# EAGLE design stm32f4discovery-daugherboard-v1-THT (EAGLE 6.2)
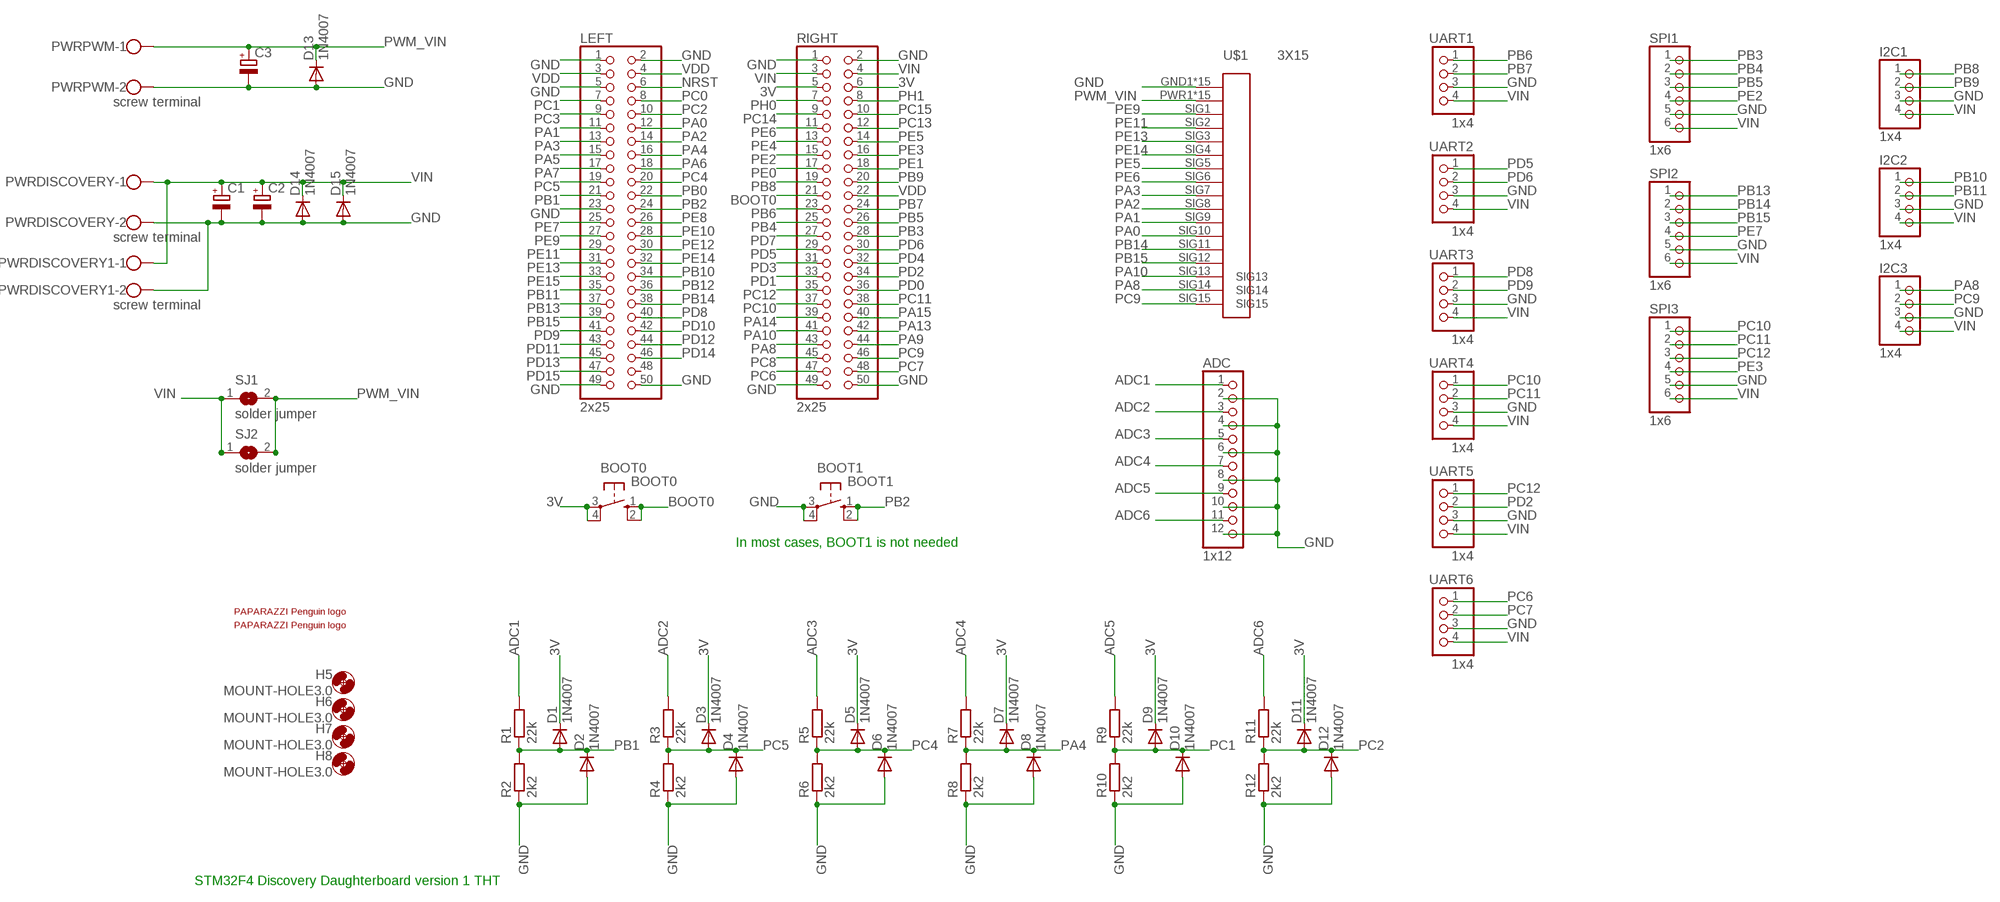
[diagram p0: schematic, sheet 1]

## Parts
ADC  1x12  PINHD-1X12/90  [1X12/90]
BOOT0  BOOT0  10-XX  [B3F-10XX]
BOOT1  BOOT1  10-XX  [B3F-10XX]
C1  CPOL-EUE5-8.5  [E5-8,5]
C2  CPOL-EUE5-8.5  [E5-8,5]
C3  CPOL-EUE5-8.5  [E5-8,5]
D1  1N4007  [DO41-7.6_2]
D2  1N4007  [DO41-7.6_2]
D3  1N4007  [DO41-7.6_2]
D4  1N4007  [DO41-7.6_2]
D5  1N4007  [DO41-7.6_2]
D6  1N4007  [DO41-7.6_2]
D7  1N4007  [DO41-7.6_2]
D8  1N4007  [DO41-7.6_2]
D9  1N4007  [DO41-7.6_2]
D10  1N4007  [DO41-7.6_2]
D11  1N4007  [DO41-7.6_2]
D12  1N4007  [DO41-7.6_2]
D13  1N4007  [DO41-7.6_2]
D14  1N4007  [DO41-7.6_2]
D15  1N4007  [DO41-7.6_2]
H5  MOUNT-HOLE3.0  [3,0]
H6  MOUNT-HOLE3.0  [3,0]
H7  MOUNT-HOLE3.0  [3,0]
H8  MOUNT-HOLE3.0  [3,0]
I2C1  1x4  PINHD-1X4/90  [1X04/90]
I2C2  1x4  PINHD-1X4/90  [1X04/90]
I2C3  1x4  PINHD-1X4/90  [1X04/90]
LEFT  2x25  PINHD-2X25  [2X25]
PWRDISCOVERY  screw terminal  W237-102  [W237-102]
PWRDISCOVERY1  screw terminal  W237-102  [W237-102]
PWRPWM  screw terminal  W237-102  [W237-102]
R1  22k  R-EU_0204/7  [0204/7]
R2  2k2  R-EU_0204/7  [0204/7]
R3  22k  R-EU_0204/7  [0204/7]
R4  2k2  R-EU_0204/7  [0204/7]
R5  22k  R-EU_0204/7  [0204/7]
R6  2k2  R-EU_0204/7  [0204/7]
R7  22k  R-EU_0204/7  [0204/7]
R8  2k2  R-EU_0204/7  [0204/7]
R9  22k  R-EU_0204/7  [0204/7]
R10  2k2  R-EU_0204/7  [0204/7]
R11  22k  R-EU_0204/7  [0204/7]
R12  2k2  R-EU_0204/7  [0204/7]
RIGHT  2x25  PINHD-2X25  [2X25]
SJ1  solder jumper  SJW  [SJW]
SJ2  solder jumper  SJW  [SJW]
SPI1  1x6  PINHD-1X6/90  [1X06/90]
SPI2  1x6  PINHD-1X6/90  [1X06/90]
SPI3  1x6  PINHD-1X6/90  [1X06/90]
U$1  3X15  [3X15]
U$2  PAPARAZZI  [PAPARAZZI]
U$4  üAüARAZZI_1400  [PAPARAZZI_1400]
UART1  1x4  PINHD-1X4/90  [1X04/90]
UART2  1x4  PINHD-1X4/90  [1X04/90]
UART3  1x4  PINHD-1X4/90  [1X04/90]
UART4  1x4  PINHD-1X4/90  [1X04/90]
UART5  1x4  PINHD-1X4/90  [1X04/90]
UART6  1x4  PINHD-1X4/90  [1X04/90]

## Nets
3V: BOOT0.3(P) BOOT0.4(P1) D1.C D3.C D5.C D7.C D9.C D11.C RIGHT.5 RIGHT.6
ADC1: ADC.1 R1.2
ADC2: ADC.3 R3.2
ADC3: ADC.5 R5.2
ADC4: ADC.7 R7.2
ADC5: ADC.9 R9.2
ADC6: ADC.11 R11.2
BOOT0: BOOT0.1(S) BOOT0.2(S1) RIGHT.21
GND: ADC.2 ADC.4 ADC.6 ADC.8 ADC.10 ADC.12 BOOT1.3(P) BOOT1.4(P1) C1.- C2.- C3.- D2.A D4.A D6.A D8.A D10.A D12.A D13.A D14.A D15.A I2C1.3 I2C2.3 I2C3.3 LEFT.1 LEFT.2 LEFT.5 LEFT.23 LEFT.49 LEFT.50 PWRDISCOVERY1.2 PWRDISCOVERY.2 PWRPWM.2 R2.1 R4.1 R6.1 R8.1 R10.1 R12.1 RIGHT.1 RIGHT.2 RIGHT.49 RIGHT.50 SPI1.5 SPI2.5 SPI3.5 U$1.GND1(GND) U$1.GND2(GND) U$1.GND3(GND) U$1.GND4(GND) U$1.GND5(GND) U$1.GND6(GND) U$1.GND7(GND) U$1.GND8(GND) U$1.GND9(GND) U$1.GND10(GND) U$1.GND11(GND) U$1.GND12(GND) U$1.GND13(GND) U$1.GND14(GND) U$1.GND15(GND) UART1.3 UART2.3 UART3.3 UART4.3 UART5.3 UART6.3
NRST: LEFT.6
PA0: LEFT.12 U$1.SIG10
PA1: LEFT.11 U$1.SIG9
PA2: LEFT.14 U$1.SIG8
PA3: LEFT.13 U$1.SIG7
PA4: D7.A D8.C LEFT.16 R7.1 R8.2
PA5: LEFT.15
PA6: LEFT.18
PA7: LEFT.17
PA8: I2C3.1 RIGHT.43 U$1.SIG14
PA9: RIGHT.44
PA10: RIGHT.41 U$1.SIG13
PA13: RIGHT.42
PA14: RIGHT.39
PA15: RIGHT.40
PB0: LEFT.22
PB1: D1.A D2.C LEFT.21 R1.1 R2.2
PB2: BOOT1.1(S) BOOT1.2(S1) LEFT.24
PB3: RIGHT.28 SPI1.1
PB4: RIGHT.25 SPI1.2
PB5: RIGHT.26 SPI1.3
PB6: RIGHT.23 UART1.1
PB7: RIGHT.24 UART1.2
PB8: I2C1.1 RIGHT.19
PB9: I2C1.2 RIGHT.20
PB10: I2C2.1 LEFT.34
PB11: I2C2.2 LEFT.35
PB12: LEFT.36
PB13: LEFT.37 SPI2.1
PB14: LEFT.38 SPI2.2 U$1.SIG11
PB15: LEFT.39 SPI2.3 U$1.SIG12
PC0: LEFT.8
PC1: D9.A D10.C LEFT.7 R9.1 R10.2
PC2: D11.A D12.C LEFT.10 R11.1 R12.2
PC3: LEFT.9
PC4: D5.A D6.C LEFT.20 R5.1 R6.2
PC5: D3.A D4.C LEFT.19 R3.1 R4.2
PC6: RIGHT.47 UART6.1
PC7: RIGHT.48 UART6.2
PC8: RIGHT.45
PC9: I2C3.2 RIGHT.46 U$1.SIG15
PC10: RIGHT.37 SPI3.1 UART4.1
PC11: RIGHT.38 SPI3.2 UART4.2
PC12: RIGHT.35 SPI3.3 UART5.1
PC13: RIGHT.12
PC14: RIGHT.9
PC15: RIGHT.10
PD0: RIGHT.36
PD1: RIGHT.33
PD2: RIGHT.34 UART5.2
PD3: RIGHT.31
PD4: RIGHT.32
PD5: RIGHT.29 UART2.1
PD6: RIGHT.30 UART2.2
PD7: RIGHT.27
PD8: LEFT.40 UART3.1
PD9: LEFT.41 UART3.2
PD10: LEFT.42
PD11: LEFT.43
PD12: LEFT.44
PD13: LEFT.45
PD14: LEFT.46
PD15: LEFT.47
PE0: RIGHT.17
PE1: RIGHT.18
PE2: RIGHT.15 SPI1.4
PE3: RIGHT.16 SPI3.4
PE4: RIGHT.13
PE5: RIGHT.14 U$1.SIG5
PE6: RIGHT.11 U$1.SIG6
PE7: LEFT.25 SPI2.4
PE8: LEFT.26
PE9: LEFT.27 U$1.SIG1
PE10: LEFT.28
PE11: LEFT.29 U$1.SIG2
PE12: LEFT.30
PE13: LEFT.31 U$1.SIG3
PE14: LEFT.32 U$1.SIG4
PE15: LEFT.33
PH0: RIGHT.7
PH1: RIGHT.8
PWM_VIN: C3.+ D13.C PWRPWM.1 SJ1.2 SJ2.2 U$1.PWR1(PWR) U$1.PWR2(PWR) U$1.PWR3(PWR) U$1.PWR4(PWR) U$1.PWR5(PWR) U$1.PWR6(PWR) U$1.PWR7(PWR) U$1.PWR8(PWR) U$1.PWR9(PWR) U$1.PWR10(PWR) U$1.PWR11(PWR) U$1.PWR12(PWR) U$1.PWR13(PWR) U$1.PWR14(PWR) U$1.PWR15(PWR)
VDD: LEFT.3 LEFT.4 RIGHT.22
VIN: C1.+ C2.+ D14.C D15.C I2C1.4 I2C2.4 I2C3.4 PWRDISCOVERY1.1 PWRDISCOVERY.1 RIGHT.3 RIGHT.4 SJ1.1 SJ2.1 SPI1.6 SPI2.6 SPI3.6 UART1.4 UART2.4 UART3.4 UART4.4 UART5.4 UART6.4
Unconnected: LEFT.48

## Notes on the sheet
- In most cases, BOOT1 is not needed
- STM32F4 Discovery Daughterboard version 1 THT

## Library data of the parts
ADC = pinhead:PINHD-1X12: PIN HEADER
BOOT0 BOOT1 = switch-omron:10-XX: OMRON SWITCH; MPN: B3F-1000; OC_FARNELL: 176432; OC_NEWARK: 36M3542
C1-C3 = rcl:CPOL-EU: POLARIZED CAPACITOR, European symbol
D1-D15 = diode:1N4007
H5-H8 = holes:MOUNT-HOLE: MOUNTING HOLE with drill center marker
I2C1-I2C3 UART1-UART6 = pinhead:PINHD-1X4: PIN HEADER
LEFT RIGHT = pinhead:PINHD-2X25: PIN HEADER
PWRDISCOVERY PWRDISCOVERY1 PWRPWM = con-wago-500:W237-102: WAGO SCREW CLAMP; MPN: 237-102; OC_FARNELL: unknown; OC_NEWARK: 70K9898
R1-R12 = rcl:R-EU_: RESISTOR, European symbol
SJ1 SJ2 = jumper:SJ: SMD solder JUMPER
SPI1-SPI3 = pinhead:PINHD-1X6: PIN HEADER
U$1 = pinhead3:3X15
U$2 = paparazzi:PAPARAZZI
U$4 = paparazzi:üAüARAZZI_1400

## Board
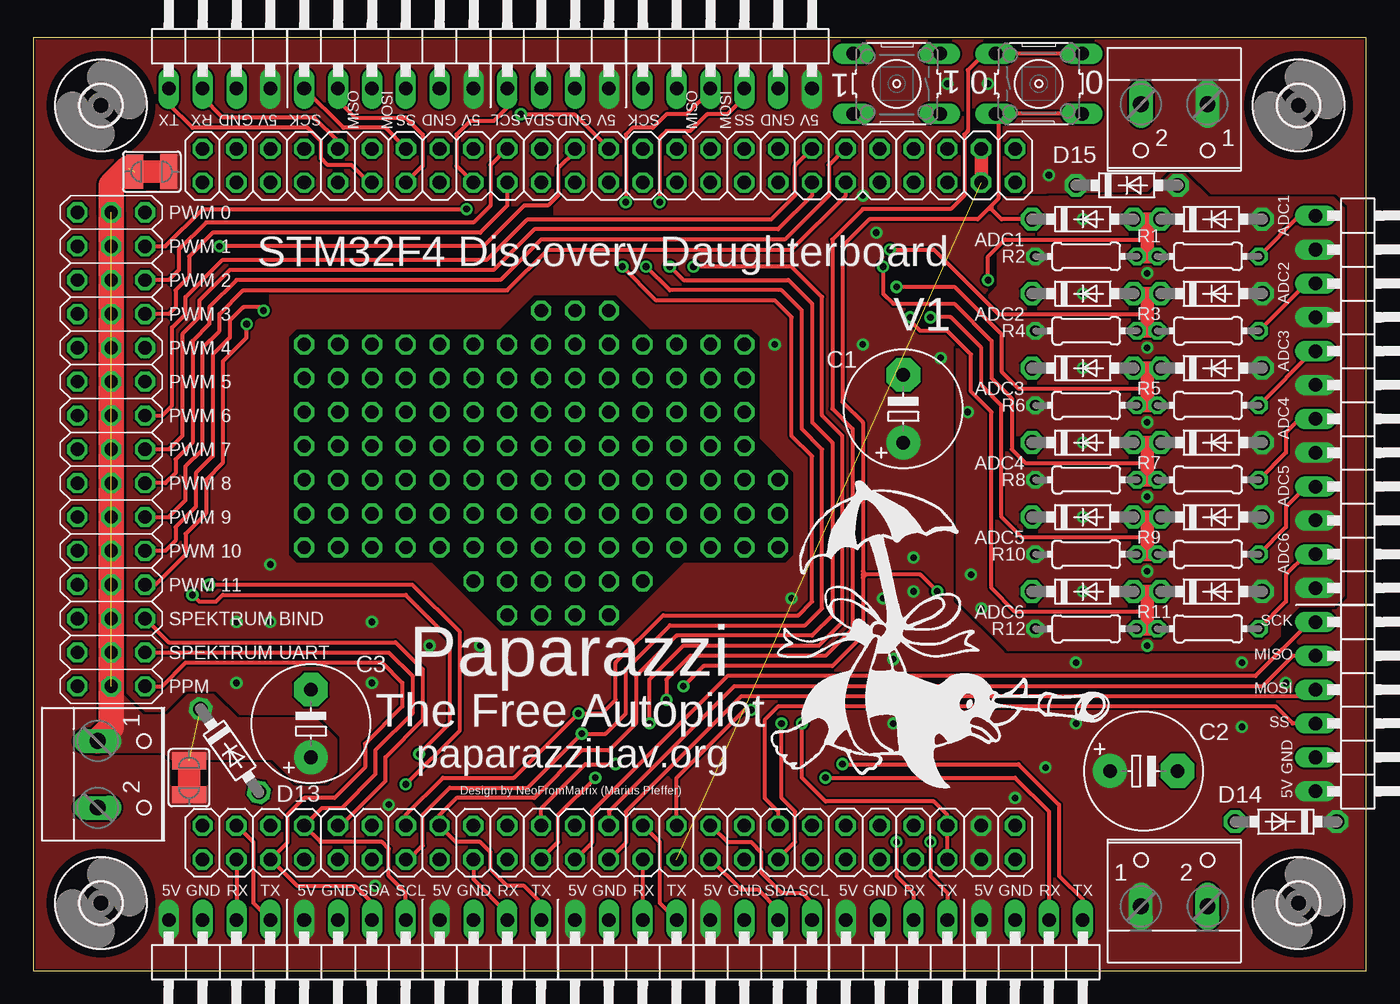
[diagram p1: board, top side]
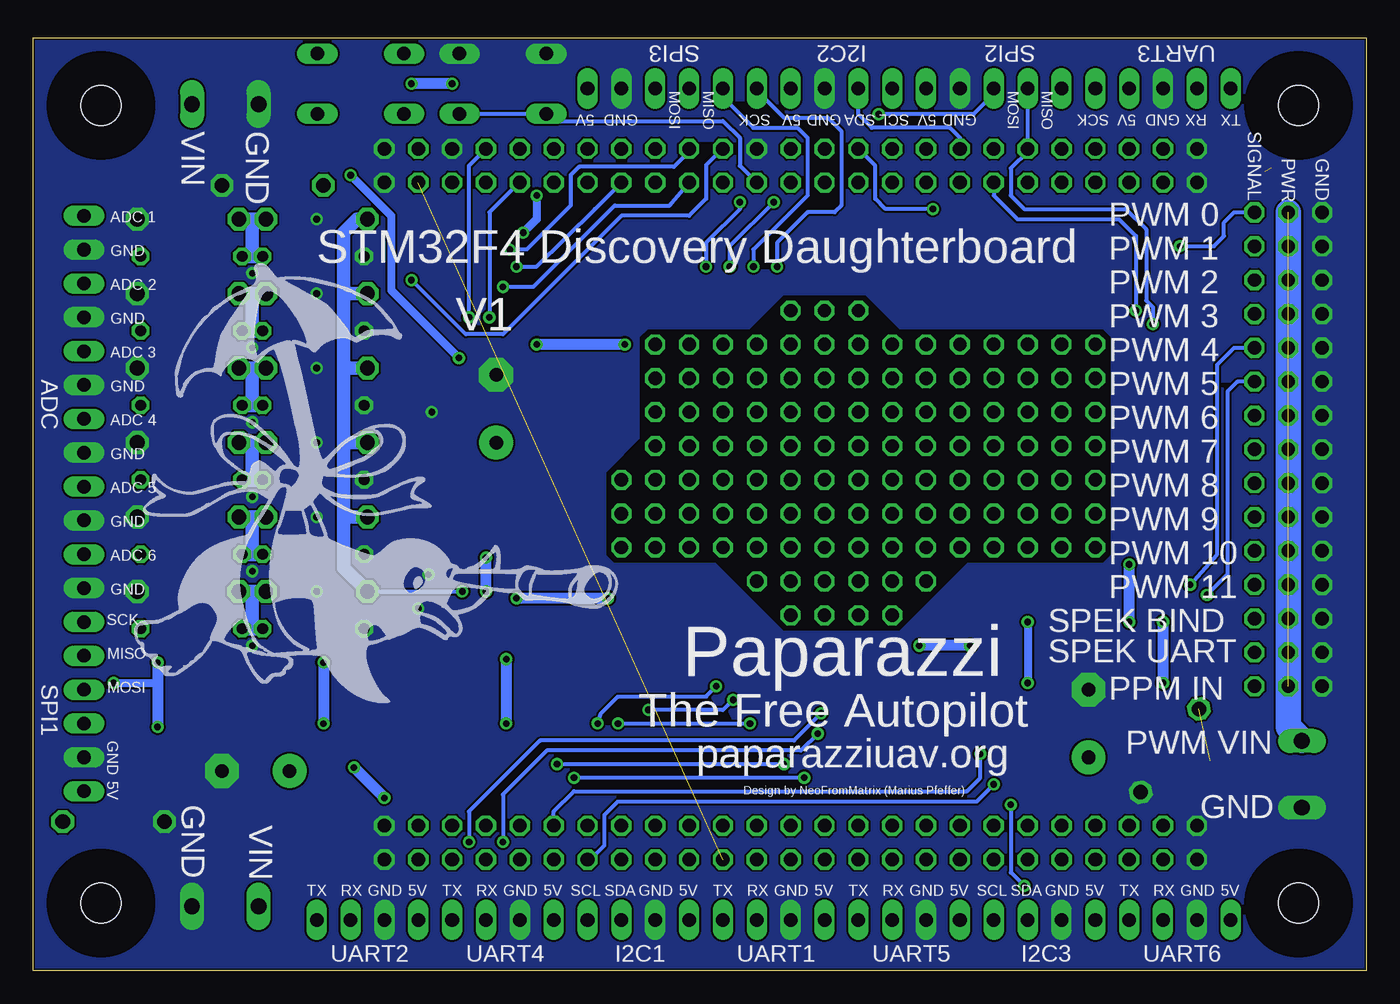
[diagram p2: board, bottom side, seen from below]

Size 100 x 70 mm. Coordinates in mm from the lower left corner, seen from the top.
Outline: 0,0 100,0 100,70 0,70 0,0
Copper layers (1*16): Top 0.035mm / dielectric 1.5mm / Bottom 0.035mm
Design rules: minimum track width 6mil, minimum drill 19mil, track to track 6mil, track to pad 6mil, pad to pad 6mil, via to via 6mil, smd to smd 6mil, copper to edge 6mil, drill to drill 6mil, minimum pad ring 10mil, minimum via ring 8mil, stop-mask expansion 4mil, vias tented up to drill 0mil, thermal gap 7mil

### Footprints (pad centres in the part's own frame; a part is rotated, then mirrored left to right if it is on the bottom)
1X12/90 = drill 1.016 long: 1 -13.97,-3.81; 2 -11.43,-3.81; 3 -8.89,-3.81; 4 -6.35,-3.81; 5 -3.81,-3.81; 6 -1.27,-3.81; 7 1.27,-3.81; 8 3.81,-3.81; 9 6.35,-3.81; 10 8.89,-3.81; 11 11.43,-3.81; 12 13.97,-3.81
B3F-10XX = drill 1.016 long: 1 -3.251,2.261; 2 3.251,2.261; 3 -3.251,-2.261; 4 3.251,-2.261
E5-8,5 = drill 1.016 pad 2.54: + -2.54,0 | drill 1.016 pad 2.54 octagon: - 2.54,0
DO41-7.6_2 = drill 1.1 pad 1.7 octagon: A 3.81,0; C -3.81,0
3,0 = hole 3: 0,0
1X04/90 = drill 1.016 long: 1 -3.81,-3.81; 2 -1.27,-3.81; 3 1.27,-3.81; 4 3.81,-3.81
2X25 = drill 1.016 octagon: 1 -30.48,-1.27; 2 -30.48,1.27; 3 -27.94,-1.27; 4 -27.94,1.27; 5 -25.4,-1.27; 6 -25.4,1.27; 7 -22.86,-1.27; 8 -22.86,1.27; 9 -20.32,-1.27; 10 -20.32,1.27; 11 -17.78,-1.27; 12 -17.78,1.27; 13 -15.24,-1.27; 14 -15.24,1.27; 15 -12.7,-1.27; 16 -12.7,1.27; 17 -10.16,-1.27; 18 -10.16,1.27; 19 -7.62,-1.27; 20 -7.62,1.27; 21 -5.08,-1.27; 22 -5.08,1.27; 23 -2.54,-1.27; 24 -2.54,1.27; 25 0,-1.27; 26 0,1.27; 27 2.54,-1.27; 28 2.54,1.27; 29 5.08,-1.27; 30 5.08,1.27; 31 7.62,-1.27; 32 7.62,1.27; 33 10.16,-1.27; 34 10.16,1.27; 35 12.7,-1.27; 36 12.7,1.27; 37 15.24,-1.27; 38 15.24,1.27; 39 17.78,-1.27; 40 17.78,1.27; 41 20.32,-1.27; 42 20.32,1.27; 43 22.86,-1.27; 44 22.86,1.27; 45 25.4,-1.27; 46 25.4,1.27; 47 27.94,-1.27; 48 27.94,1.27; 49 30.48,-1.27; 50 30.48,1.27
W237-102 = drill 1.194 long: 1 -2.5,-1.27; 2 2.5,-1.27
0204/7 = drill 0.813 octagon: 1 -3.81,0; 2 3.81,0
SJW = smd 1.27 x 2.54: 1 -1.27,0; 2 1.27,0
1X06/90 = drill 1.016 long: 1 -6.35,-3.81; 2 -3.81,-3.81; 3 -1.27,-3.81; 4 1.27,-3.81; 5 3.81,-3.81; 6 6.35,-3.81
3X15 = drill 1 octagon: GND1 -17.78,-2.54; GND2 -15.24,-2.54; GND3 -12.7,-2.54; GND4 -10.16,-2.54; GND5 -7.62,-2.54; GND6 -5.08,-2.54; GND7 -2.54,-2.54; GND8 0,-2.54; GND9 2.54,-2.54; GND10 5.08,-2.54; GND11 7.62,-2.54; GND12 10.16,-2.54; GND13 12.7,-2.54; GND14 15.24,-2.54; GND15 17.78,-2.54; PWR1 -17.78,0; PWR2 -15.24,0; PWR3 -12.7,0; PWR4 -10.16,0; PWR5 -7.62,0; PWR6 -5.08,0; PWR7 -2.54,0; PWR8 0,0; PWR9 2.54,0; PWR10 5.08,0; PWR11 7.62,0; PWR12 10.16,0; PWR13 12.7,0; PWR14 15.24,0; PWR15 17.78,0; SIG1 -17.78,2.54; SIG2 -15.24,2.54; SIG3 -12.7,2.54; SIG4 -10.16,2.54; SIG5 -7.62,2.54; SIG6 -5.08,2.54; SIG7 -2.54,2.54; SIG8 0,2.54; SIG9 2.54,2.54; SIG10 5.08,2.54; SIG11 7.62,2.54; SIG12 10.16,2.54; SIG13 12.7,2.54; SIG14 15.24,2.54; SIG15 17.78,2.54

### Placement (x,y rotation side)
ADC  100,42.67 270 top
BOOT0  75.44,66.55 0 top
BOOT1  64.77,66.55 180 top
C1  65.28,42.16 90 top
C2  83.31,14.99 0 top
C3  20.83,18.54 90 top
D1  78.74,56.39 0 top
D2  88.39,56.39 0 top
D3  78.74,50.8 0 top
D4  88.39,50.8 0 top
D5  78.74,45.21 0 top
D6  88.39,45.21 0 top
D7  78.74,39.62 0 top
D8  88.39,39.62 0 top
D9  78.74,34.04 0 top
D10  88.39,34.04 0 top
D11  78.74,28.45 0 top
D12  88.39,28.45 0 top
D13  14.73,16.51 305 top
D14  93.98,11.18 180 top
D15  82.04,58.93 0 top
H5  94.92,5.08 0 top
H6  5.08,5.08 0 top
H7  94.92,64.92 0 top
H8  5.08,64.92 0 top
I2C1  54.61,0 180 top
I2C2  39.37,70 0 top
I2C3  24.13,0 180 top
LEFT  43.18,60.4 180 top
PWRDISCOVERY  85.6,63.75 180 top
PWRDISCOVERY1  85.6,6.1 0 top
PWRPWM  6.1,14.73 270 top
R1  88.14,53.59 0 top
R2  78.99,53.59 0 top
R3  88.14,48.01 0 top
R4  78.99,48.01 0 top
R5  88.14,42.42 0 top
R6  78.99,42.42 0 top
R7  88.14,36.83 0 top
R8  78.99,36.83 0 top
R9  88.14,31.24 0 top
R10  78.99,31.24 0 top
R11  88.14,25.65 0 top
R12  78.99,25.65 0 top
RIGHT  43.18,9.6 180 top
SJ1  11.68,14.48 90 top
SJ2  8.89,59.94 180 top
SPI1  100,19.81 270 top
SPI2  26.67,70 0 top
SPI3  52.07,70 0 top
U$1  5.84,39.12 270 top
U$2  93.47,19.05 0 bottom
U$4  54.61,12.95 0 top
UART1  44.45,0 180 top
UART2  74.93,0 180 top
UART3  13.97,70 0 top
UART4  64.77,0 180 top
UART5  34.29,0 180 top
UART6  13.97,0 180 top

### Tracks (layer width: path | path; a pad name or v marks a point on that pad's centre or on a via)
3V  (via drill 0.5)
  Top 0.305: RIGHT.6 RIGHT.5 68.58,11.68 67.56,12.7 59.44,12.7 57.66,14.48 v57.66,18.54 | BOOT0.4 BOOT0.3 72.19,64.21 72.39,64.01 72.39,57.91 71.88,57.4 | 71.88,57.4 71.75,57.28 | 71.75,57.28 71.63,57.15 | 71.63,57.15 70.87,56.39 62.74,56.39 60.71,54.36 60.71,42.67 62.23,41.15 62.23,29.97 | 62.23,29.72 62.23,29.46 | 62.23,29.46 62.23,25.15 59.94,22.86 50.29,22.86 v48.77,21.34 | D1.C 72.64,56.39 71.88,57.15 | 71.88,57.15 71.75,57.28 | v67.82,28.45 66.55,29.72 62.48,29.72 | 62.48,29.72 62.23,29.72 | 62.48,29.72 62.23,29.97 | 62.23,29.97 62.23,29.72 | 62.23,29.46 62.48,29.72 | 71.88,57.4 71.88,57.15 | 71.88,57.15 71.63,57.15
  Bottom 0.305: v57.66,18.54 57.4,19.3 56.13,20.57 49.53,20.57 v48.77,21.34 | D11.C v67.82,28.45
  Bottom 1.016: D1.C 75.69,56.39 76.71,55.37 76.71,50.8 | 76.71,50.8 76.71,45.21 | 76.71,45.21 76.71,39.62 | 76.71,39.62 76.71,34.04 | 76.71,34.04 76.71,30.23 D11.C | D9.C 76.71,34.04 | D7.C 76.71,39.62 | D5.C 76.71,45.21 | D3.C 76.71,50.8
ADC1
  Top 0.305: ADC.1 95,56.64 R1.2
ADC2
  Top 0.305: ADC.3 95.5,51.56 R3.2
ADC3
  Top 0.305: ADC.5 96.01,46.48 R5.2
  cutout Top: 23.37,62.48 23.37,62.74 23.11,62.74
ADC4
  Top 0.305: ADC.7 95,41.4 93.98,40.39 93.98,38.86 R7.2
ADC5
  Top 0.305: ADC.9 95.5,36.32 93.98,34.8 93.98,33.27 R9.2
ADC6
  Top 0.305: ADC.11 95.5,31.24 93.98,29.72 93.98,27.69 R11.2
BOOT0  (via drill 0.5)
  Top 0.305: RIGHT.21 48.26,14.48 53.34,19.56 v53.85,19.56 | BOOT0.2 BOOT0.1 71.35,68.81 70.1,67.56 70.1,62.99 69.85,62.74 69.85,58.17 68.83,57.15 62.23,57.15 59.94,54.86 59.94,42.16 61.47,40.64 61.47,25.65 59.44,23.62 49.28,23.62 47.5,21.84 v47.5,20.32
  Bottom 0.305: v47.5,20.32 48.26,19.56 v53.85,19.56
GND  (via drill 0.5)
  other vias: 70.1,41.91 83.57,46.74 83.57,41.15 83.57,35.56 83.57,24.38 70.36,29.72 83.57,52.32 78.74,56.39 78.74,50.8 78.74,45.21 78.74,39.62 78.74,34.04 83.57,29.97 78.74,28.45 71.12,27.18
  pour Top (no thermals): 98.3,57.15 97.54,57.91 88.14,57.91 86.36,59.69 85.34,59.69 83.82,58.17 72.39,57.91 72.39,51.31 69.34,48.01 69.34,27.94 73.15,24.13 92.46,24.13 93.47,25.15 93.47,25.91 95,27.43 97.54,27.43 98.3,28.19
  pour Bottom (rank 3, no thermals): 0,0 100.08,0 100.08,70.1 0,70.1
  cutout Top (rank 2): 8.38,61.21 9.4,61.21 9.4,58.67 8.38,58.67
N$1
  pour Bottom: 66.29,49.02 66.8,49.02 66.8,48.77 66.55,48.51 66.55,48.77
N$2
  cutout Top (rank 2): 10.41,15.49 10.41,13.97 12.95,13.97 12.95,15.49
N$3
  cutout Top: 35.81,57.15 36.07,57.15 35.81,56.9
N$4
  Top 1.676: 11.68,13.72 11.68,15.24
N$5
  cutout Top: 92.71,23.88 92.96,23.62 92.96,23.88
N$6
  Top 1.676: 8.13,59.94 9.65,59.94
N$7  (via drill 1)
  other vias: 22.86,46.99
N$9  (via drill 1)
  other vias: 20.32,46.99
N$10
  cutout Top: 94.49,24.64 94.74,24.38 94.74,24.13 94.74,24.38
N$12
  cutout Top: 37.59,12.7 37.85,12.45 38.1,12.7
N$13
  cutout Top: 10.16,54.36 10.67,53.85 10.67,54.36
N$14
  cutout Top: 10.16,51.56 10.41,51.31 10.67,51.56
N$15
  cutout Top: 10.16,49.02 10.41,48.77 10.67,49.02
N$16
  cutout Top: 10.16,38.86 10.41,38.61 10.67,38.86
N$17
  cutout Top: 10.16,33.78 10.41,33.53 10.67,33.78
N$18
  cutout Top: 38.86,57.15 38.86,56.64 38.61,56.64 38.61,56.9
N$19
  cutout Top: 16.51,48.77 16.76,49.02 16.76,49.28 16.76,49.02
N$20
  cutout Bottom: 10.41,43.94 10.92,43.94 10.67,43.94 10.41,43.69
N$21
  cutout Bottom: 30.99,64.01 30.99,63.5 31.5,64.01
N$22  (via drill 1)
  other vias: 25.4,46.99
N$24  (via drill 1)
  other vias: 27.94,46.99
N$25  (via drill 1)
  other vias: 30.48,46.99
N$26  (via drill 1)
  other vias: 33.02,46.99
N$27  (via drill 1)
  other vias: 35.56,46.99
N$28  (via drill 1)
  other vias: 38.1,46.99
N$29  (via drill 1)
  other vias: 40.64,46.99
N$30  (via drill 1)
  other vias: 43.18,46.99
N$31  (via drill 1)
  other vias: 45.72,46.99
N$32  (via drill 1)
  other vias: 48.26,46.99
N$33  (via drill 1)
  other vias: 50.8,46.99
N$34  (via drill 1)
  other vias: 20.32,44.45
N$35  (via drill 1)
  other vias: 20.32,41.91
N$36  (via drill 1)
  other vias: 20.32,39.37
N$37  (via drill 1)
  other vias: 22.86,44.45
N$38  (via drill 1)
  other vias: 25.4,44.45
N$39  (via drill 1)
  other vias: 27.94,44.45
N$40  (via drill 1)
  other vias: 30.48,44.45
N$41  (via drill 1)
  other vias: 33.02,44.45
N$42  (via drill 1)
  other vias: 35.56,44.45
N$43  (via drill 1)
  other vias: 38.1,44.45
N$44  (via drill 1)
  other vias: 40.64,44.45
N$45  (via drill 1)
  other vias: 43.18,44.45
N$46  (via drill 1)
  other vias: 45.72,44.45
N$47  (via drill 1)
  other vias: 48.26,44.45
N$48  (via drill 1)
  other vias: 50.8,44.45
N$49  (via drill 1)
  other vias: 22.86,41.91
N$50  (via drill 1)
  other vias: 25.4,41.91
N$51  (via drill 1)
  other vias: 27.94,41.91
N$52  (via drill 1)
  other vias: 30.48,41.91
N$53  (via drill 1)
  other vias: 33.02,41.91
N$54  (via drill 1)
  other vias: 35.56,41.91
N$55  (via drill 1)
  other vias: 20.32,36.83
N$56  (via drill 1)
  other vias: 38.1,41.91
N$57  (via drill 1)
  other vias: 40.64,41.91
N$58  (via drill 1)
  other vias: 43.18,41.91
N$59  (via drill 1)
  other vias: 45.72,41.91
N$60  (via drill 1)
  other vias: 48.26,41.91
N$61  (via drill 1)
  other vias: 50.8,41.91
N$62  (via drill 1)
  other vias: 22.86,39.37
N$63  (via drill 1)
  other vias: 25.4,39.37
N$64  (via drill 1)
  other vias: 27.94,39.37
N$65  (via drill 1)
  other vias: 30.48,39.37
N$66  (via drill 1)
  other vias: 33.02,39.37
N$67  (via drill 1)
  other vias: 35.56,39.37
N$68  (via drill 1)
  other vias: 38.1,39.37
N$69  (via drill 1)
  other vias: 40.64,39.37
N$70  (via drill 1)
  other vias: 43.18,39.37
N$71  (via drill 1)
  other vias: 45.72,39.37
N$72  (via drill 1)
  other vias: 48.26,39.37
N$73  (via drill 1)
  other vias: 50.8,39.37
N$74  (via drill 1)
  other vias: 22.86,36.83
N$75  (via drill 1)
  other vias: 25.4,36.83
N$76  (via drill 1)
  other vias: 27.94,36.83
N$77  (via drill 1)
  other vias: 30.48,36.83
N$78  (via drill 1)
  other vias: 33.02,36.83
N$79  (via drill 1)
  other vias: 35.56,36.83
N$80  (via drill 1)
  other vias: 38.1,36.83
N$81  (via drill 1)
  other vias: 40.64,36.83
N$82  (via drill 1)
  other vias: 43.18,36.83
N$83  (via drill 1)
  other vias: 45.72,36.83
N$84  (via drill 1)
  other vias: 48.26,36.83
N$85  (via drill 1)
  other vias: 50.8,36.83
N$86  (via drill 1)
  other vias: 20.32,34.29
N$87  (via drill 1)
  other vias: 22.86,34.29
N$88  (via drill 1)
  other vias: 25.4,34.29
N$89  (via drill 1)
  other vias: 27.94,34.29
N$90  (via drill 1)
  other vias: 30.48,34.29
N$91  (via drill 1)
  other vias: 33.02,34.29
N$92  (via drill 1)
  other vias: 35.56,34.29
N$93  (via drill 1)
  other vias: 38.1,34.29
N$94  (via drill 1)
  other vias: 40.64,34.29
N$95  (via drill 1)
  other vias: 43.18,34.29
N$96  (via drill 1)
  other vias: 45.72,34.29
N$97  (via drill 1)
  other vias: 48.26,34.29
N$98  (via drill 1)
  other vias: 50.8,34.29
N$99  (via drill 1)
  other vias: 20.32,31.75
N$100  (via drill 1)
  other vias: 22.86,31.75
N$101  (via drill 1)
  other vias: 25.4,31.75
N$102  (via drill 1)
  other vias: 27.94,31.75
N$103  (via drill 1)
  other vias: 30.48,31.75
N$104  (via drill 1)
  other vias: 33.02,31.75
N$105  (via drill 1)
  other vias: 35.56,31.75
N$106  (via drill 1)
  other vias: 38.1,31.75
N$107  (via drill 1)
  other vias: 40.64,31.75
N$108  (via drill 1)
  other vias: 43.18,31.75
N$109  (via drill 1)
  other vias: 45.72,31.75
N$110  (via drill 1)
  other vias: 48.26,31.75
N$111  (via drill 1)
  other vias: 50.8,31.75
N$112  (via drill 1)
  other vias: 53.34,46.99
N$113  (via drill 1)
  other vias: 53.34,44.45
N$114  (via drill 1)
  other vias: 53.34,41.91
N$115  (via drill 1)
  other vias: 53.34,39.37
N$116  (via drill 1)
  other vias: 53.34,36.83
N$117  (via drill 1)
  other vias: 53.34,34.29
N$118  (via drill 1)
  other vias: 53.34,31.75
N$119  (via drill 1)
  other vias: 55.88,34.29
N$120
  cutout Top: 19.81,30.73 29.97,30.73 35.05,25.65 43.69,25.65 48.77,30.73 56.39,30.73 56.9,31.24 56.9,37.34 54.36,39.88 54.36,47.5 53.85,48.01 46.23,48.01 43.69,50.55 37.59,50.55 35.05,48.01 19.81,48.01 19.3,47.5 19.3,31.24
N$121
  cutout Bottom: 19.81,48.01 19.3,47.5 19.3,31.24 19.81,30.73 29.97,30.73 35.05,25.65 43.69,25.65 48.77,30.73 56.39,30.73 56.9,31.24 56.9,37.34 54.36,39.88 54.36,47.5 53.85,48.01 46.23,48.01 43.69,50.55 37.59,50.55 35.05,48.01
N$122  (via drill 1)
  other vias: 35.56,26.67
N$123  (via drill 1)
  other vias: 38.1,26.67
N$124  (via drill 1)
  other vias: 40.64,26.67
N$125  (via drill 1)
  other vias: 55.88,31.75
N$126  (via drill 1)
  other vias: 43.18,26.67
N$127  (via drill 1)
  other vias: 38.1,49.53
N$128  (via drill 1)
  other vias: 33.02,29.21
N$129  (via drill 1)
  other vias: 35.56,29.21
N$130  (via drill 1)
  other vias: 38.1,29.21
N$131  (via drill 1)
  other vias: 40.64,29.21
N$132  (via drill 1)
  other vias: 43.18,29.21
N$133  (via drill 1)
  other vias: 45.72,29.21
N$134  (via drill 1)
  other vias: 40.64,49.53
N$135  (via drill 1)
  other vias: 43.18,49.53
N$136
  cutout Top: 17.53,50.04 17.53,50.8 17.02,50.29 17.27,50.29
N$137
  cutout Top: 48.01,14.48 47.75,14.73 48.01,14.73
N$138  (via drill 1)
  other vias: 55.88,36.83
N$139
  cutout Bottom: 48.01,19.3 47.75,18.8 48.01,18.8
N$140
  cutout Bottom: 49.28,20.32 49.02,19.81 49.28,19.81
N$141
  cutout Bottom: 56.64,18.54 57.15,18.54 56.9,18.8
N$142
  cutout Bottom: 44.7,52.83 45.47,52.83 45.21,52.83 45.21,53.09 44.7,53.09
N$143
  cutout Bottom: 49.28,61.98 49.78,61.98 49.53,61.98 49.53,61.72 49.28,61.72
N$144
  cutout Bottom: 46.74,65.02 47.24,65.02 46.99,65.02 46.99,64.77 46.74,64.77
PA0
  Top 0.305: U$1.SIG10 10.16,34.04 11.43,35.31 11.43,37.85 12.7,39.12 12.7,46.74 13.97,48.01 13.97,49.28 15.75,51.05 35.56,51.05 38.61,54.1 56.9,54.1 60.96,58.17 LEFT.12
PA1
  Top 0.305: 60.91,61.67 59.69,60.45 59.69,58.17 56.39,54.86 38.1,54.86 35.05,51.82 15.24,51.82 13.21,49.78 13.21,48.51 11.94,47.24 11.94,39.62 10.67,38.35 10.67,37.34 9.91,36.58 U$1.SIG9
  Top 0.406: LEFT.11 60.91,61.67
PA2
  Top 0.305: LEFT.14 58.42,58.17 55.88,55.63 37.59,55.63 34.54,52.58 14.73,52.58 12.45,50.29 12.45,49.02 11.18,47.75 11.18,40.13 10.16,39.12 U$1.SIG8
PA3
  Top 0.305: U$1.SIG7 9.65,41.66 10.41,42.42 10.41,48.26 11.43,49.28 11.43,50.55 14.22,53.34 34.04,53.34 37.08,56.39 55.37,56.39 57.15,58.17 57.15,60.4 LEFT.13
PA4  (via drill 0.5)
  Top 0.305: v63.75,52.83 63.75,50.8 64.52,50.04 69.09,50.04 71.88,47.24 71.88,44.45 73.41,42.93 73.41,39.12 74.42,38.1 83.57,38.1
  Top 1.016: R8.2 R7.1 83.57,36.83 83.57,38.1 83.57,39.62 D7.A D8.C
  Bottom 0.305: v63.75,52.83 62.23,52.83 57.86,57.15 LEFT.16
  Bottom 1.016: R7.1 R8.2 83.57,36.83 83.57,39.62 D7.A D8.C
PA8
  Top 0.305: I2C3.1 27.94,5.84 26.67,7.11 26.67,9.14 26.16,9.65 21.54,9.65 RIGHT.43 21.64,12.19 23.11,12.19 25.65,14.73 25.65,16.51 28.45,19.3 28.45,22.1 26.67,23.88 U$1.SIG14
PA10
  Top 0.305: U$1.SIG13 10.16,24.64 27.18,24.64 29.21,22.61 29.21,18.8 26.42,16 26.42,14.22 23.06,10.87 RIGHT.41
PB1  (via drill 0.5)
  Top 0.305: v71.63,51.82 71.63,53.59 72.9,54.86 83.57,54.86
  Top 1.016: R2.2 R1.1 83.57,53.59 83.57,54.86 83.57,56.39 | 83.57,56.39 D2.C | 83.57,56.39 D1.A
  Bottom 0.305: LEFT.21 48.31,61.67 49.53,60.45 49.53,57.91 50.8,56.64 55.88,56.64 64.77,47.75 67.56,47.75 v71.63,51.82
  Bottom 1.016: R1.1 R2.2 83.57,53.59 83.57,56.39 D1.A D2.C
PB2
  Bottom 0.305: BOOT1.1 BOOT1.2 61.49,64.29 61.21,63.75 48.26,63.75 46.99,62.48 46.99,60.4 LEFT.24
PB3
  Top 0.305: SPI1.1 95.76,26.16 91.69,22.1 52.07,22.1 41.91,11.94 41.91,9.6 RIGHT.28
PB4
  Top 0.305: SPI1.2 94.49,23.62 92.2,21.34 52.58,21.34 43.18,11.94 RIGHT.25
PB5
  Top 0.305: SPI1.3 96.01,21.08 95.5,20.57 53.09,20.57 44.45,11.94 44.45,9.6 RIGHT.26
PB6
  Top 0.305: RIGHT.23 45.77,10.87 46.99,9.65 46.99,5.08 UART1.1
PB7
  Top 0.305: RIGHT.24 UART1.2
PB8
  Top 0.305: RIGHT.19 50.85,10.87 52.07,9.65 53.85,9.65 54.61,8.89 54.61,7.37 56.13,5.84 57.66,5.84 58.42,5.08 I2C1.1
PB9
  Top 0.305: RIGHT.20 50.85,8.33 53.09,6.1 54.36,6.1 55.88,4.57 I2C1.2
PB10
  Top 0.305: I2C2.1 35.56,64.77 34.54,63.75 32.77,63.75 31.75,62.74 31.75,60.4 LEFT.34
PB11
  Bottom 0.305: LEFT.35 30.48,62.48 31.24,63.25 37.08,63.25 38.1,64.26 I2C2.2
PB13
  Top 0.305: LEFT.37 27.94,61.72 26.42,63.25 23.26,63.25 SPI2.1
PB14  (via drill 0.5)
  Top 0.305: SPI2.2 22.86,65.28 24.13,64.01 27.94,64.01 29.21,62.74 29.21,60.4 LEFT.38 | v17.27,49.53 17.02,49.78 15.75,49.78 14.73,48.77 14.73,47.5 13.46,46.23 13.46,38.61 12.19,37.34 12.19,34.8 10.67,33.27 10.67,32.26 9.91,31.5 U$1.SIG11
  Bottom 0.305: LEFT.38 27.94,58.17 26.16,56.39 18.54,56.39 17.27,55.12 v17.27,49.53
PB15  (via drill 0.5)
  Top 0.305: U$1.SIG12 9.14,28.96 11.43,31.24 11.43,32.77 12.95,34.29 12.95,36.83 14.22,38.1 14.22,45.72 16,47.5 v16,48.51
  Bottom 0.305: SPI2.3 LEFT.39 25.4,61.47 26.67,60.2 26.67,58.17 25.65,57.15 18.03,57.15 16.51,55.63 16.51,50.29 16,49.78 v16,48.51
PC1  (via drill 0.5)
  Top 0.305: v67.31,49.02 68.83,49.02 71.12,46.74 71.12,43.94 72.64,42.42 72.64,34.04 74.17,32.51 83.57,32.51 | D9.A 83.31,34.04 83.57,33.78
  Top 1.016: R9.1 83.57,31.24 | 83.57,31.24 R10.2 | D9.A D10.C 83.57,34.04 83.57,33.78 83.57,32.51 83.57,31.24
  Bottom 0.305: v67.31,49.02 67.31,60.4 LEFT.7
  Bottom 1.016: R9.1 R10.2 83.57,31.24 83.57,34.04 D9.A D10.C
PC2  (via drill 0.5)
  Top 0.305: v65.79,49.02 65.79,48.77 66.55,48.01 68.58,48.01 70.36,46.23 70.36,43.43 71.88,41.91 71.88,28.7 73.66,26.92 83.57,26.92 | D11.A 83.31,28.45 83.57,28.19
  Top 1.016: R11.1 R12.2 83.57,25.65 83.57,26.92 83.57,28.19 83.57,28.45 | 83.57,28.45 D11.A | D12.C 83.57,28.45
  Bottom 0.305: LEFT.10 63.55,59.13 65.79,56.9 v65.79,49.02
  Bottom 1.016: R11.1 R12.2 83.57,25.65 83.57,28.45 D11.A D12.C
PC4  (via drill 0.5)
  Top 0.305: v64.77,51.31 69.09,51.31 72.64,47.75 72.64,44.96 73.91,43.69 83.31,43.69 83.57,43.43
  Top 1.016: R6.2 R5.1 83.57,42.42 83.57,43.43 83.57,45.21 D5.A D6.C
  Bottom 0.305: v64.77,51.31 62.48,51.31 56.39,57.4 52.27,57.4 LEFT.20
  Bottom 1.016: R5.1 R6.2 83.57,42.42 83.57,45.21 D5.A D6.C
PC5  (via drill 0.5)
  Top 0.305: v64.26,54.1 67.56,54.1 72.39,49.28 83.57,49.28
  Top 1.016: R4.2 R3.1 83.57,48.01 83.57,49.28 83.57,50.8 | 83.57,50.8 D4.C | 83.57,50.8 D3.A
  Bottom 0.305: LEFT.19 50.8,61.47 51.94,60.33 59.05,60.33 59.69,59.69 59.69,57.4 62.99,54.1 v64.26,54.1
  Bottom 1.016: R3.1 R4.2 83.57,48.01 83.57,50.8 D3.A D4.C
PC6
  Top 0.305: RIGHT.47 15.29,10.87 16.51,9.65 16.51,5.08 UART6.1
PC7
  Top 0.305: RIGHT.48 UART6.2
PC9
  Top 0.305: I2C3.2 25.4,5.08 24.13,6.35 19.81,6.35 17.83,8.33 RIGHT.46 19.05,9.6 19.05,11.68 20.32,12.95 22.61,12.95 24.89,15.24 24.89,17.02 27.69,19.81 27.69,21.59 26.16,23.11 11.43,23.11 9.65,21.34 U$1.SIG15
PC10  (via drill 0.5)
  Top 0.305: RIGHT.37 27.94,11.68 30.73,14.48 36.07,14.48 v40.89,19.3 42.67,19.3 43.69,20.32 43.69,23.11 47.24,26.67 57.4,26.67 58.42,27.69 58.42,38.61 56.9,40.13 56.9,49.02 55.63,50.29 46.74,50.29 v44.2,52.83 | v67.31,9.65 67.31,7.11 68.58,5.84 UART4.1
  Bottom 0.305: v44.2,52.83 44.2,54.61 41.91,56.9 39.88,56.9 39.37,57.4 39.37,62.99 40.39,64.01 43.69,64.01 45.72,66.04 SPI3.1 | v40.89,19.3 42.93,17.27 61.98,17.27 67.31,11.94 v67.31,9.65
PC11  (via drill 0.5)
  Top 0.305: RIGHT.38 28.14,8.33 29.21,9.4 29.21,11.68 31.24,13.72 37.08,13.72 v41.15,17.78 42.93,17.78 44.45,19.3 44.45,22.61 47.75,25.91 57.91,25.91 59.18,27.18 59.18,39.12 57.66,40.64 57.66,49.53 56.13,51.05 47.75,51.05 v45.97,52.83 | v64.77,9.65 64.77,7.11 66.04,5.84 UART4.2
  Bottom 0.305: v45.97,52.83 45.97,54.1 41.91,58.17 41.91,62.48 42.67,63.25 45.97,63.25 48.26,65.53 SPI3.2 | v41.15,17.78 42.42,16.51 61.47,16.51 64.77,13.21 v64.77,9.65
PC12  (via drill 0.5)
  Top 0.305: SPI3.3 50.8,66.04 49.02,64.26 47.5,64.26 46.48,63.25 44.96,63.25 44.45,62.74 v44.45,57.66 | v47.75,52.83 48.77,51.82 56.64,51.82 58.42,50.04 58.42,41.15 59.94,39.62 59.94,26.67 58.42,25.15 48.26,25.15 45.21,22.1 45.21,18.54 43.18,16.51 41.15,16.51 37.59,12.95 31.75,12.95 30.48,11.68 RIGHT.35 31.7,9.65 33.53,9.65 34.29,8.89 34.29,7.62 35.56,6.35 36.83,6.35 38.1,5.08 UART5.1
  Bottom 0.305: v44.45,57.66 47.75,54.36 v47.75,52.83
PD2
  Top 0.305: RIGHT.34 33.02,6.86 35.56,4.32 UART5.2
PD5  (via drill 0.5)
  Top 0.305: RIGHT.29 38.1,12.19 41.4,15.49 v43.69,15.49 | v60.71,15.49 73.91,15.49 76.96,12.45 76.96,7.11 78.74,5.33 UART2.1
  Bottom 0.305: v43.69,15.49 v60.71,15.49
PD6  (via drill 0.5)
  Top 0.305: RIGHT.30 38.1,8.38 39.37,9.65 39.37,11.68 v42.16,14.48 | v59.44,14.48 73.66,14.48 76.2,11.94 UART2.2
  Bottom 0.305: v42.16,14.48 v59.44,14.48
PD8
  Top 0.305: LEFT.40 25.2,59.13 23.88,60.45 22.1,60.45 21.59,60.96 21.59,62.23 20.57,63.25 11.94,63.25 10.16,65.02 UART3.1
PD9
  Top 0.305: LEFT.41 22.86,62.23 21.08,64.01 14.22,64.01 12.7,65.53 UART3.2
PE2
  Top 0.305: SPI1.4 94.49,18.54 93.22,19.81 55.88,19.81 54.86,18.8 54.86,12.95 55.88,11.94 RIGHT.15
PE3  (via drill 0.5)
  Top 0.305: RIGHT.16 55.88,8.38 57.15,9.65 57.15,11.94 56.13,12.95 v56.13,18.54 | SPI3.4 53.34,65.53 52.07,64.26 50.55,64.26 49.28,62.99 47.5,62.99 46.99,62.48 v46.99,57.66 | v46.23,18.54 46.23,21.84 48.77,24.38 58.93,24.38 60.71,26.16 60.71,40.13 59.18,41.66 59.18,50.55 56.9,52.83 v49.53,52.83
  Bottom 0.305: v46.99,57.66 46.99,57.15 49.53,54.61 v49.53,52.83 | v56.13,18.54 v46.23,18.54
PE5  (via drill 0.5)
  Top 0.305: v27.94,13.97 32,18.03 32,25.4 28.45,28.96 v13.21,28.96
  Bottom 0.305: 58.22,8.33 57.15,9.4 57.15,11.68 56.13,12.7 29.21,12.7 v27.94,13.97 | v13.21,28.96 11.18,31.24 11.18,45.47 9.91,46.74 U$1.SIG5
  Bottom 0.406: RIGHT.14 58.22,8.33
PE6  (via drill 0.5)
  Top 0.305: v11.94,28.19 12.45,27.69 13.72,27.69 14.22,28.19 27.94,28.19 31.24,24.89 31.24,18.54 v28.96,16.26
  Bottom 0.305: U$1.SIG6 9.65,44.2 10.41,43.43 10.41,29.72 v11.94,28.19 | RIGHT.11 60.96,11.94 59.44,13.46 29.97,13.46 28.96,14.48 v28.96,16.26
PE7  (via drill 0.5)
  Top 0.305: v36.58,64.26 40.59,64.26 LEFT.25
  Bottom 0.305: SPI2.4 27.94,65.79 29.46,64.26 v36.58,64.26
PE9  (via drill 0.5)
  Top 0.305: LEFT.27 40.64,61.47 39.37,60.2 39.37,58.17 38.61,57.4 36.83,57.4 33.78,54.36 v13.97,54.36
  Bottom 0.305: v13.97,54.36 11.43,54.36 10.67,55.12 10.67,56.13 9.91,56.9 U$1.SIG1
PE11  (via drill 0.5)
  Top 0.305: U$1.SIG2 9.91,54.36 12.7,57.15 v32.51,57.15
  Bottom 0.305: v32.51,57.15 36.07,57.15 36.83,57.91 36.83,60.4 LEFT.29
PE13
  Top 0.305: LEFT.31 35.51,61.67 34.29,60.45 34.29,57.4 33.02,56.13 12.95,56.13 10.92,54.1 10.92,52.58 10.16,51.82 U$1.SIG3
PE14
  Top 0.305: LEFT.32 35.56,57.4 33.53,55.37 13.46,55.37 11.68,53.59 11.68,52.07 10.67,51.05 10.67,49.78 10.16,49.28 U$1.SIG4
PWM_VIN  (16 unrouted)
  Top 1.93: 7.11,60.2 5.84,58.93 U$1.PWR1 5.84,18.25 PWRPWM.1
  Bottom 1.93: U$1.PWR1 5.84,18.29 4.83,17.27
  pour Top (no thermals): 4.83,16.51 9.91,16.51 10.41,16 18.03,16 19.81,14.22 21.84,14.22 22.61,14.99 22.61,17.27 21.08,18.8 15.24,18.8 13.46,20.57 11.68,20.57 10.16,19.05 8.13,19.05 6.6,20.57 6.1,20.07 6.1,18.54 4.83,17.27
VDD  (1 unrouted)
  Top 1.016: LEFT.3 LEFT.4
VIN  (via drill 0.5)
  Bottom 0.305: v26.67,12.45 26.67,7.37 v25.65,6.35
  Bottom 0.61: v93.98,21.59 90.68,21.59 | v25.4,26.16 v25.4,21.59 | v62.23,58.17 62.23,56.39 v63.25,55.37 | v76.2,59.69 73.15,56.64 73.15,51.05 v68.07,45.97
  Bottom 0.813: v68.58,66.55 v71.63,66.55 | v78.23,23.11 v78.23,18.54 | v90.68,23.11 90.68,21.59 v90.68,18.29 | v56.9,27.94 v63.75,27.94 | v55.63,46.99 v62.23,46.99 | v15.24,26.16 v15.24,21.59 | v17.78,26.16 v17.78,30.48 | v29.72,24.38 v33.53,24.38 | v64.52,23.37 v64.52,18.54 | v66.04,28.45 v66.04,30.99 | v73.66,12.95 v75.95,15.24
  pour Top (rank 2, no thermals): 0,0 100.08,0 100.08,70.1 0,70.1

### Text on the board
tNames: 1 | 0 | 0 | 1 | MISO | MOSI | MISO | MOSI | TX | RX | GND | 5V | SCK | SS | GND | 5V | SCL | SDA | GND | 5V | SCK | SS | GND | 5V | PWM 0 | ADC1 | PWM 1 | ADC1 | STM32F4 Discovery Daughterboard | PWM 2 | ADC2 | PWM 3 | ADC2 | V1 | PWM 4 | ADC3 | PWM 5 | ADC3 | PWM 6 | ADC4 | PWM 7 | ADC4 | PWM 8 | ADC5 | PWM 9 | ADC5 | PWM 10 | ADC6 | PWM 11 | SCK | SPEKTRUM BIND | ADC6 | MISO | SPEKTRUM UART | Paparazzi | MOSI | PPM | SS | The Free Autopilot | paparazziuav.org | GND | Design by NeoFromMatrix (Marius Pfeffer) | 5V | 5V | GND | RX | TX | 5V | GND | SDA | SCL | 5V | GND | RX | TX | 5V | GND | RX | TX | 5V | GND | SDA | SCL | 5V | GND | RX | TX | 5V | GND | RX | TX
bNames: MISO | MOSI | MISO | MOSI | TX | RX | GND | 5V | SCK | GND | 5V | SCL | SDA | GND | 5V | SCK | GND | 5V | SIGNAL | GND | VIN | GND | PWR | PWM 0 | ADC 1 | GND | PWM 1 | STM32F4 Discovery Daughterboard | PWM 2 | ADC 2 | GND | PWM 3 | V1 | PWM 4 | ADC 3 | PWM 5 | GND | PWM 6 | ADC 4 | PWM 7 | GND | PWM 8 | ADC 5 | PWM 9 | GND | ADC 6 | PWM 10 | PWM 11 | GND | SCK | SPEK BIND | SPEK UART | MISO | Paparazzi | MOSI | PPM IN | The Free Autopilot | GND | PWM VIN | paparazziuav.org | 5V | Design by NeoFromMatrix (Marius Pfeffer) | GND | GND | VIN | 5V | GND | RX | TX | 5V | GND | SDA | SCL | 5V | GND | RX | TX | 5V | GND | RX | TX | 5V | GND | SDA | SCL | 5V | GND | RX | TX | 5V | GND | RX | TX